# Altium schematic sheet Power.SchDoc
size A; SheetNumber: 3; SheetTotal: 5
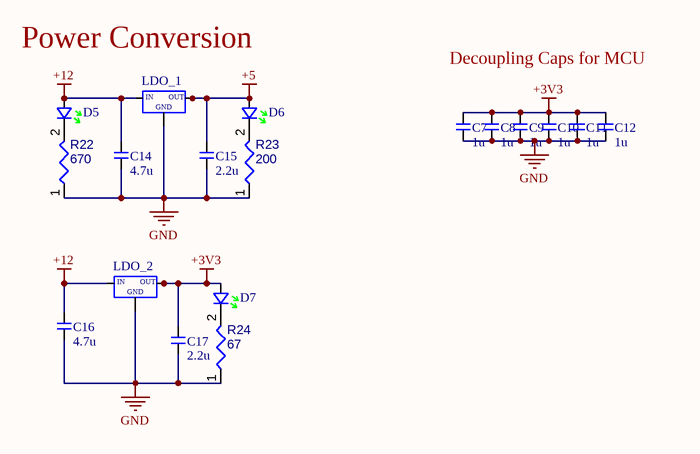
[diagram p0: Power.SchDoc]

## Parts
C7  1u  [CAP-0603]
C8  1u  [CAP-0603]
C9  1u  [CAP-0603]
C10  1u  [CAP-0603]
C11  1u  [CAP-0603]
C12  1u  [CAP-0603]
C14  4.7u  [CAP-0603]
C15  2.2u  [CAP-0603]
C16  4.7u  [CAP-0603]
C17  2.2u  [CAP-0603]
D5  LEDGREEN-1806-RIGHT  [LEDGREEN-1806-RIGHT]  (value not drawn)
D6  LEDGREEN-1806-RIGHT  [LEDGREEN-1806-RIGHT]  (value not drawn)
D7  LEDGREEN-1806-RIGHT  [LEDGREEN-1806-RIGHT]  (value not drawn)
LDO_1  LDO-SOT223_SPX1117  [SOT223]  (value not drawn)
LDO_2  LDO-SOT223_SPX1117  [SOT223]  (value not drawn)
R22  670  [RESC0805(2012)_L]
R23  200  [RESC0805(2012)_L]
R24  67  [RESC0805(2012)_L]

## Nets
+3V3: C7.1 C8.1 C9.1 C10.1 C11.1 C12.1 C17.1 D7.A LDO_2.2 LDO_2.4
+5: C15.1 D6.A LDO_1.2 LDO_1.4
+12: C14.1 C16.1 D5.A LDO_1.3 LDO_2.3
GND: C7.2 C8.2 C9.2 C10.2 C11.2 C12.2 C14.2 C15.2 C16.2 C17.2 LDO_1.1 LDO_2.1 R22.1 R23.1 R24.1
NetD5_K: D5.K R22.2
NetD6_K: D6.K R23.2
NetD7_K: D7.K R24.2

## Notes on the sheet
- Power Conversion
- Decoupling Caps for MCU
- (in symbol CMP-056-000415-1) IN; OUT; GND

## Library data of the parts
C7-C12 C14-C17 = CMP-050-000018-1: Design Item ID: CAP-0603; Source: ife19_Elec_Library.SchLib
D5-D7 = CMP-056-000417-1: Source: ife19_Elec_Library.SchLib; Design Item ID: LEDGREEN-1806-RIGHT
LDO_1 LDO_2 = CMP-056-000415-1: Design Item ID: LDO-SOT223_SPX1117; Source: ife19_Elec_Library.SchLib
R22-R24 = CMP-009-000150-1: Chip Resistor, 43,2 kOhms, +/-1 %, 63 mW, -55 to 155 degC, 0402; Available Preview Images: 2D; Source: Integrated_Library - 12.03.21 - 15.39.SchLib; Design Item ID: CMP-009-00154-2